# Altium project Slave v2.PrjPCB
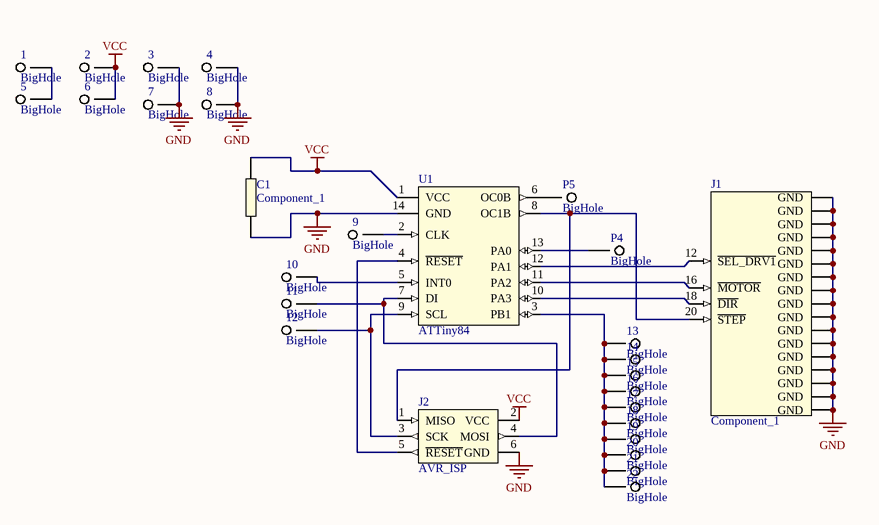
[diagram p0: Slave v2.SchDoc]
1 sheet, 28 parts. Net scope: global (net labels, ports and power ports of the same name join across sheets).
Board files: Slave v2.PcbDoc, 4xboard.PcbDoc

## Sheet Slave v2.SchDoc
size A4

### Parts
1  BigHole  [MEDHOLE]
2  BigHole  [MEDHOLE]
3  BigHole  [MEDHOLE]
4  BigHole  [MEDHOLE]
5  BigHole  [MEDHOLE]
6  BigHole  [MEDHOLE]
7  BigHole  [MEDHOLE]
8  BigHole  [MEDHOLE]
9  BigHole  [MEDHOLE]
10  BigHole  [MEDHOLE]
11  BigHole  [MEDHOLE]
12  BigHole  [MEDHOLE]
13  BigHole  [BigHole]
14  BigHole  [BigHole]
15  BigHole  [BigHole]
16  BigHole  [BigHole]
17  BigHole  [BigHole]
18  BigHole  [BigHole]
19  BigHole  [BigHole]
20  BigHole  [BigHole]
21  BigHole  [BigHole]
22  BigHole  [BigHole]
C1  Component_1  [200mil]
J1  Component_1  [Header34]
J2  AVR_ISP  [HEADER6]
P4  BigHole  [MEDHOLE]
P5  BigHole  [MEDHOLE]
U1  ATTiny84  [DIP14]

### Nets
GND: 3.1(Pin?) 4.1(Pin?) 7.1(Pin?) 8.1(Pin?) C1.1 J1.1(GND) J1.3(GND) J1.5(GND) J1.7(GND) J1.9(GND) J1.11(GND) J1.13(GND) J1.15(GND) J1.17(GND) J1.19(GND) J1.21(GND) J1.23(GND) J1.25(GND) J1.27(GND) J1.29(GND) J1.31(GND) J1.33(GND) J2.6(GND) U1.14(GND)
VCC: 2.1(Pin?) 6.1(Pin?) C1.2 J2.2(VCC) U1.1(VCC)
Net1_1: 1.1(Pin?) 5.1(Pin?)
Net9_1: 9.1(Pin?) U1.2(CLK)
Net10_1: 10.1(Pin?) U1.5(INT0)
Net11_1: 11.1(Pin?) J2.4(MOSI) U1.7(DI)
Net12_1: 12.1(Pin?) J2.3(SCK) U1.9(SCL)
Net13_1: 13.1(Pin?) 14.1(Pin?) 15.1(Pin?) 16.1(Pin?) 17.1(Pin?) 18.1(Pin?) 19.1(Pin?) 20.1(Pin?) 21.1(Pin?) 22.1(Pin?) U1.3(PB1)
NetJ1_12: J1.12(~{SEL_DRV1}) U1.12(PA1)
NetJ1_16: J1.16(~{MOTOR}) U1.11(PA2)
NetJ1_18: J1.18(~{DIR}) U1.10(PA3)
NetJ1_20: J1.20(~{STEP}) J2.1(MISO) U1.8(OC1B)
NetJ2_5: J2.5(~{RESET}) U1.4(~{RESET})
NetP4_1: P4.1(Pin?) U1.13(PA0)
NetP5_1: P5.1(Pin?) U1.6(OC0B)